# Altium schematic sheet Schem_Control_2021-08-04.schdoc
size 432 x 271 mm
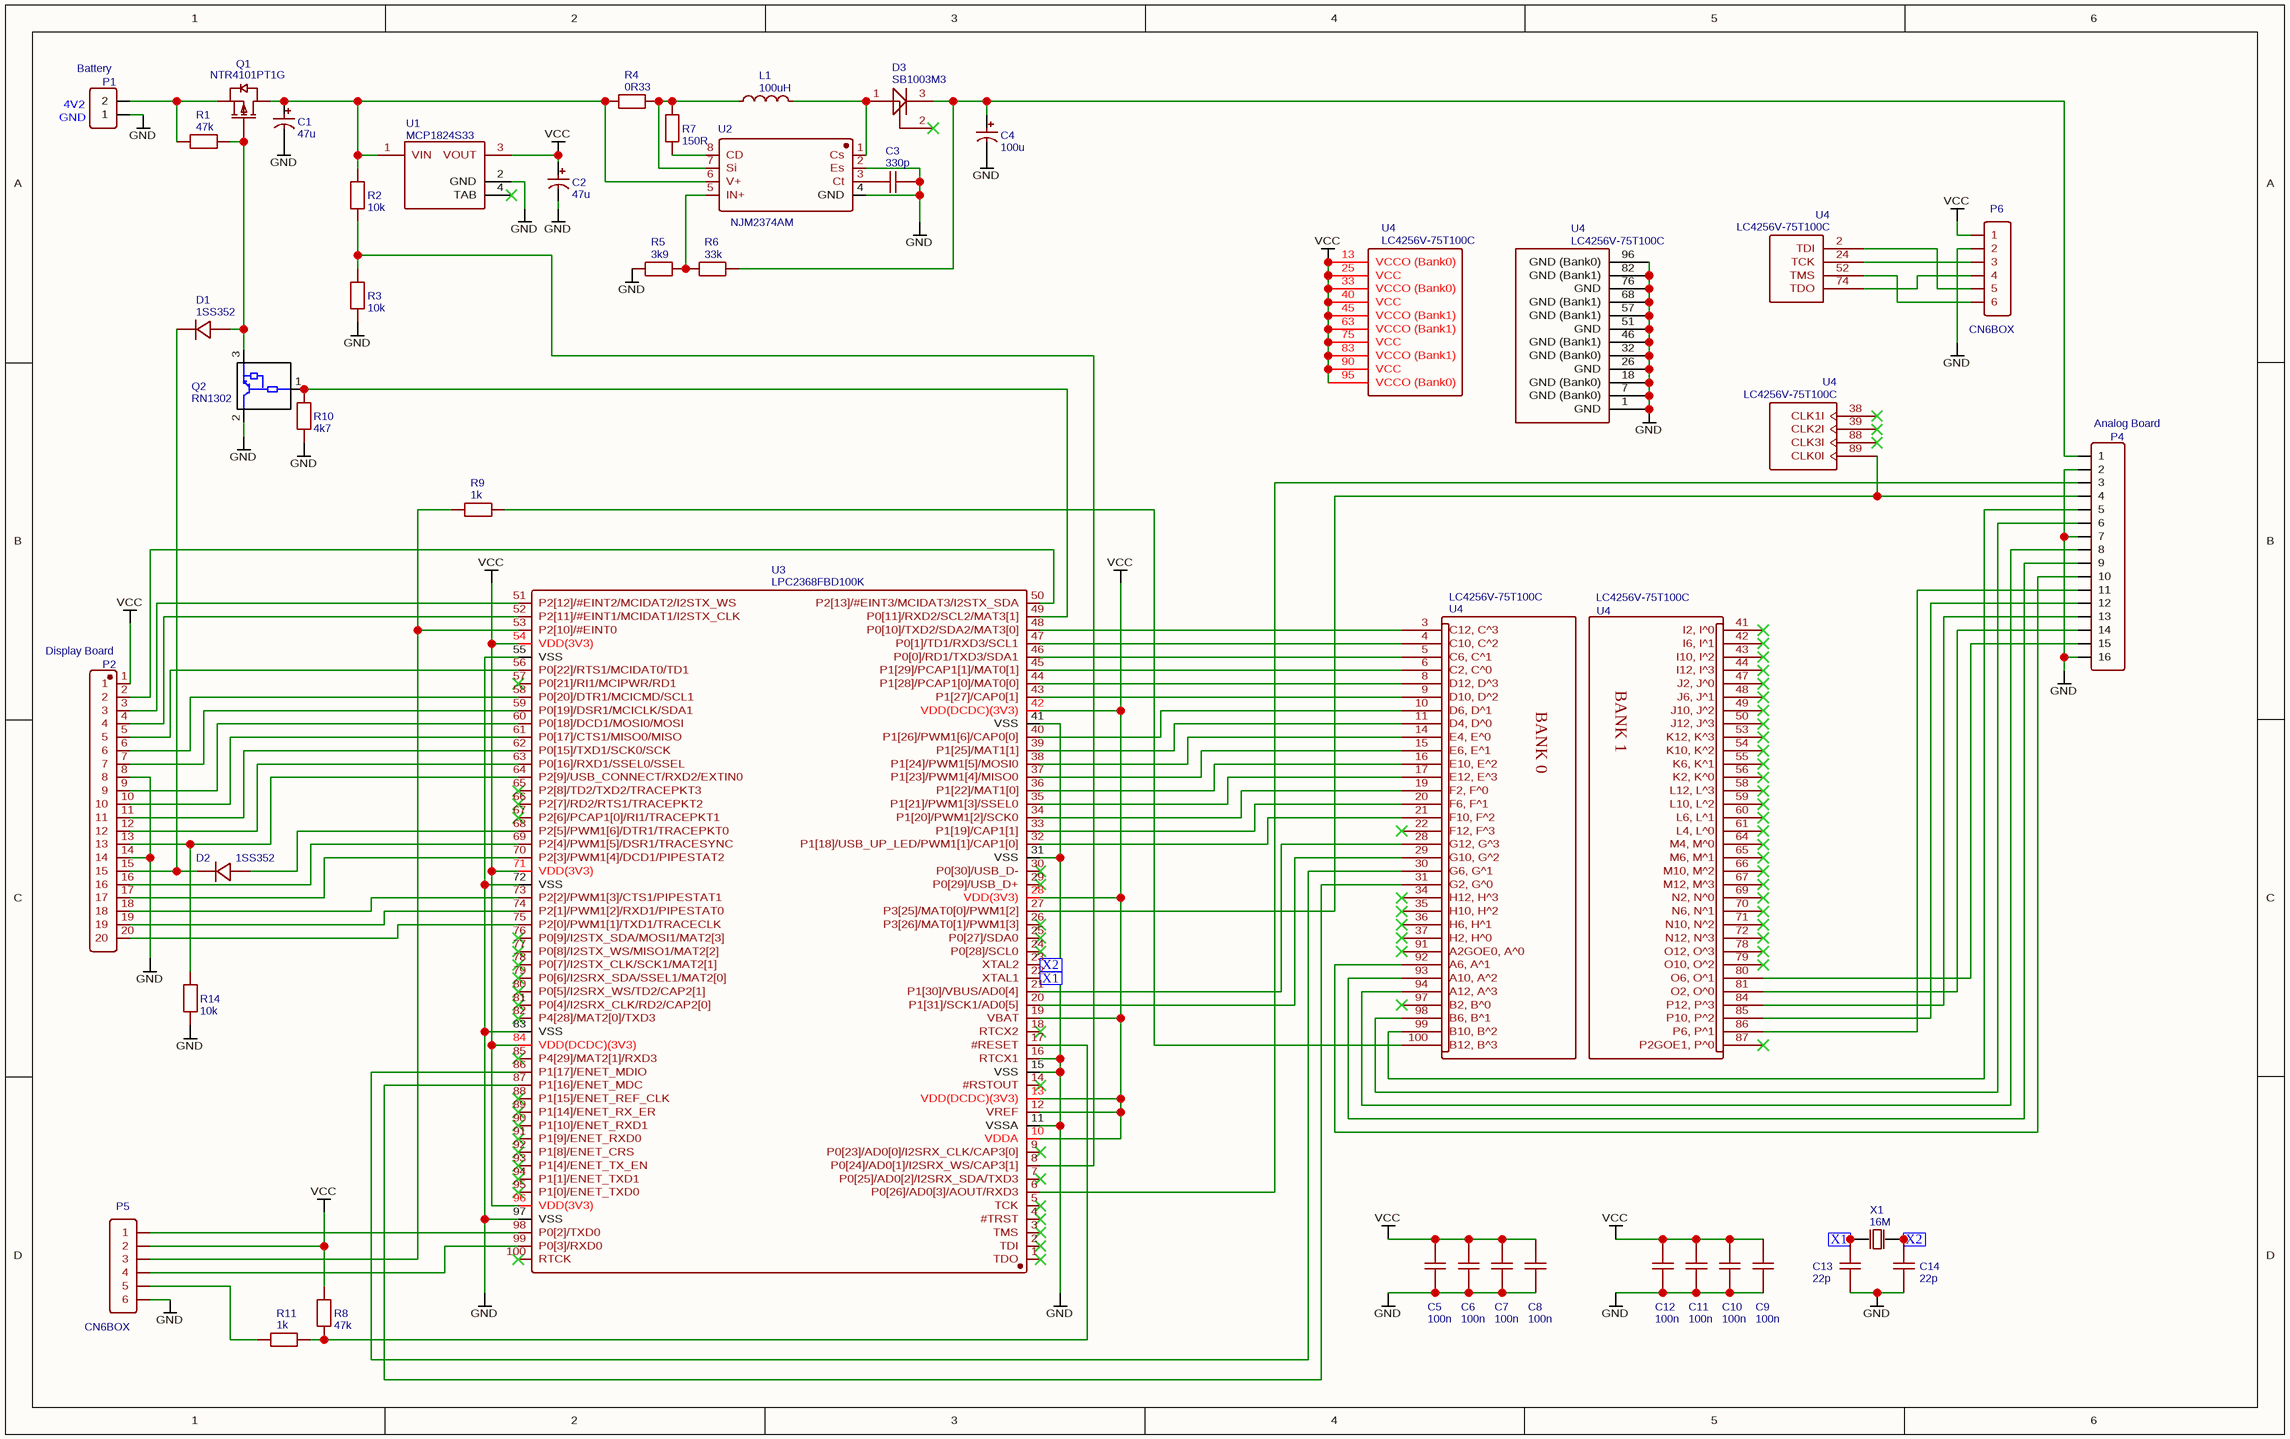
[diagram p0: Schem_Control_2021-08-04.schdoc]

## Parts
(Parts that share a designator on the sheet are numbered #1, #2 ... from top to bottom, then left to right.)
C1  47u  [CAP-TH_BD5.0-P2.00-D0.8-FD]
C2  47u  [CAP-TH_BD5.0-P2.00-D0.8-FD]
C3  330p  [RAD-0.1]
C4  100u  [CAP-TH_BD5.0-P2.00-D0.8-FD]
C5  100n  [RAD-0.1]
C6  100n  [RAD-0.1]
C7  100n  [RAD-0.1]
C8  100n  [RAD-0.1]
C9  100n  [RAD-0.1]
C10  100n  [RAD-0.1]
C11  100n  [RAD-0.1]
C12  100n  [RAD-0.1]
C13  22p  [RAD-0.1]
C14  22p  [RAD-0.1]
D1  1SS352  [SOD-323_L1.8-W1.3-LS2.5-RD]
D2  1SS352  [SOD-323_L1.8-W1.3-LS2.5-RD]
D3  SB1003M3  [-ONSC-MCPH-3_V]
L1  100uH  [IND-TH_BD8.5-P5.00-D0.6]
P1  Battery  [HDR-F-2.54_1X2]
P2  Display Board  [HDR-TH_20P-P2.54-V]
P4  Analog Board  [HDR-TH_16P-P2.54-V]
P5  CN6BOX  [HDR-TH_6P-P2.54-V]
P6  CN6BOX  [HDR-TH_6P-P2.54-V]
Q1  NTR4101PT1G  [SOT-23-3_L2.9-W1.6-P1.90-LS2.8-BR]
Q2  RN1302  [SOT-323-3_L2.0-W1.3-P1.30-LS2.1-BR]
R1  47k  [R_AXIAL-0.3]
R2  10k  [R_AXIAL-0.3]
R3  10k  [R_AXIAL-0.3]
R4  0R33  [R_AXIAL-0.3]
R5  3k9  [R_AXIAL-0.3]
R6  33k  [R_AXIAL-0.3]
R7  150R  [R_AXIAL-0.3]
R8  47k  [R_AXIAL-0.3]
R9  1k  [R_AXIAL-0.3]
R10  4k7  [R_AXIAL-0.3]
R11  1k  [R_AXIAL-0.3]
R14  10k  [R_AXIAL-0.3]
U1  MCP1824S33  [SOT-223_L6.5-W3.5-P2.30-LS7.0-BR]
U2  NJM2374AM  [SOIC-8_L5.3-W5.3-P1.27-LS8.0-BL]
U3  LPC2368FBD100K  [LQFP-100_L14.0-W14.0-P0.50-LS16.0-BL]
U4#1  LC4256V-75T100C  [TQFP100]
U4#2  LC4256V-75T100C  [TQFP100]
U4#3  LC4256V-75T100C  [TQFP100]
U4#4  LC4256V-75T100C  [TQFP100]
U4#5  LC4256V-75T100C  [TQFP100]
U4#6  LC4256V-75T100C  [TQFP100]
X1  16M  [HC-49S_L11.0-W4.4-P4.88]

## Ports
X1 (in), X2 (in)

## Nets
GND: C1.2 C2.2 C3.2 C4.2 C5.1 C6.1 C7.1 C8.1 C9.1 C10.1 C11.1 C12.1 C13.1 C14.1 P1.1 P2.8 P2.14 P4.2 P4.7 P4.16 P5.6 P6.2 Q2.2 R3.1 R5.2 R10.1 R14.1 U1.2(GND) U2.2(Es) U2.4(GND) U3.11(VSSA) U3.15(VSS) U3.16(RTCX1) U3.31(VSS) U3.41(VSS) U3.55(VSS) U3.72(VSS) U3.83(VSS) U3.97(VSS) U4#3.1(GND) U4#3.7(GND_(Bank0)) U4#3.18(GND_(Bank0)) U4#3.26(GND) U4#3.32(GND_(Bank0)) U4#3.46(GND_(Bank1)) U4#3.51(GND) U4#3.57(GND_(Bank1)) U4#3.68(GND_(Bank1)) U4#3.76(GND) U4#3.82(GND_(Bank1)) U4#3.96(GND_(Bank0))
VCC: C2.1 C5.2 C6.2 C7.2 C8.2 C9.2 C10.2 C11.2 C12.2 P2.1 P5.2 P6.1 R8.1 U1.3(VOUT) U3.10(VDDA) U3.12(VREF) U3.13(VDD(DCDC)(3V3)) U3.19(VBAT) U3.28(VDD(3V3)) U3.42(VDD(DCDC)(3V3)) U3.54(VDD(3V3)) U3.71(VDD(3V3)) U3.84(VDD(DCDC)(3V3)) U3.96(VDD(3V3)) U4#2.13(VCCO_(Bank0)) U4#2.25(VCC) U4#2.33(VCCO_(Bank0)) U4#2.40(VCC) U4#2.45(VCCO_(Bank1)) U4#2.63(VCCO_(Bank1)) U4#2.75(VCC) U4#2.83(VCCO_(Bank1)) U4#2.90(VCC) U4#2.95(VCCO_(Bank0))
X1: C13.2 U3.22(XTAL1) X1.1(OSC1) ; port X1
X2: C14.2 U3.23(XTAL2) X1.2(OSC2) ; port X2
NetC1_1: C1.1 Q1.3(D) R2.2 R4.2 U1.1(VIN) U2.6(V+)
NetC3_1: C3.1 U2.3(Ct)
NetC4_1: C4.1 D3.3(K) P4.1 R6.1
NetD1_1: D1.1(K) D2.1(K) P2.15
NetD1_2: D1.2(A) Q1.1(G) Q2.3 R1.2
NetD2_2: D2.2(A) U3.68(P2[5]/PWM1[6]/DTR1/TRACEPKT0)
NetD3_1: D3.1(A) L1.2 U2.1(Cs)
NetL1_1: L1.1 R4.1 R7.1 U2.7(Si)
NetP1_2: P1.2 Q1.2(S) R1.1
NetP2_2: P2.2 U3.50(P2[13]/#EINT3/MCIDAT3/I2STX_SDA)
NetP2_3: P2.3 U3.51(P2[12]/#EINT2/MCIDAT2/I2STX_WS)
NetP2_4: P2.4 U3.52(P2[11]/#EINT1/MCIDAT1/I2STX_CLK)
NetP2_5: P2.5 U3.56(P0[22]/RTS1/MCIDAT0/TD1)
NetP2_6: P2.6 U3.58(P0[20]/DTR1/MCICMD/SCL1)
NetP2_7: P2.7 U3.59(P0[19]/DSR1/MCICLK/SDA1)
NetP2_9: P2.9 U3.60(P0[18]/DCD1/MOSI0/MOSI)
NetP2_10: P2.10 U3.61(P0[17]/CTS1/MISO0/MISO)
NetP2_11: P2.11 U3.62(P0[15]/TXD1/SCK0/SCK)
NetP2_12: P2.12 U3.63(P0[16]/RXD1/SSEL0/SSEL)
NetP2_13: P2.13 R14.2 U3.64(P2[9]/USB_CONNECT/RXD2/EXTIN0)
NetP2_16: P2.16 U3.69(P2[4]/PWM1[5]/DSR1/TRACESYNC)
NetP2_17: P2.17 U3.70(P2[3]/PWM1[4]/DCD1/PIPESTAT2)
NetP2_18: P2.18 U3.73(P2[2]/PWM1[3]/CTS1/PIPESTAT1)
NetP2_19: P2.19 U3.74(P2[1]/PWM1[2]/RXD1/PIPESTAT0)
NetP2_20: P2.20 U3.75(P2[0]/PWM1[1]/TXD1/TRACECLK)
NetP4_3: P4.3 U3.6(P0[26]/AD0[3]/AOUT/RXD3)
NetP4_4: P4.4 U3.27(P3[25]/MAT0[0]/PWM1[2]) U4#4.89(CLK0I)
NetP4_5: P4.5 U4#5.99(B10,_B^2)
NetP4_6: P4.6 U4#5.98(B6,_B^1)
NetP4_8: P4.8 U4#5.94(A12,_A^3)
NetP4_9: P4.9 U4#5.93(A10,_A^2)
NetP4_10: P4.10 U4#5.92(A6,_A^1)
NetP4_11: P4.11 U4#6.86(P6,_P^1)
NetP4_12: P4.12 U4#6.85(P10,_P^2)
NetP4_13: P4.13 U4#6.84(P12,_P^3)
NetP4_14: P4.14 U4#6.81(O2,_O^0)
NetP4_15: P4.15 U4#6.80(O6,_O^1)
NetP5_1: P5.1 U3.98(P0[2]/TXD0)
NetP5_3: P5.3 R9.2 U3.53(P2[10]/#EINT0)
NetP5_4: P5.4 U3.99(P0[3]/RXD0)
NetP5_5: P5.5 R11.2
NetP6_3: P6.3 U4#1.24(TCK)
NetP6_4: P6.4 U4#1.74(TDO)
NetP6_5: P6.5 U4#1.2(TDI)
NetP6_6: P6.6 U4#1.52(TMS)
NetQ2_1: Q2.1 R10.2 U3.49(P0[11]/RXD2/SCL2/MAT3[1])
NetR2_1: R2.1 R3.2 U3.8(P0[24]/AD0[1]/I2SRX_WS/CAP3[1])
NetR5_1: R5.1 R6.2 U2.5(IN+)
NetR7_2: R7.2 U2.8(CD)
NetR8_2: R8.2 R11.1 U3.17(#RESET)
NetR9_1: R9.1 U4#5.100(B12,_B^3)
NetU3_20: U3.20(P1[31]/SCK1/AD0[5]) U4#5.29(G10,_G^2)
NetU3_21: U3.21(P1[30]/VBUS/AD0[4]) U4#5.28(G12,_G^3)
NetU3_32: U3.32(P1[18]/USB_UP_LED/PWM1[1]/CAP1[0]) U4#5.21(F10,_F^2)
NetU3_33: U3.33(P1[19]/CAP1[1]) U4#5.20(F6,_F^1)
NetU3_34: U3.34(P1[20]/PWM1[2]/SCK0) U4#5.19(F2,_F^0)
NetU3_35: U3.35(P1[21]/PWM1[3]/SSEL0) U4#5.17(E12,_E^3)
NetU3_36: U3.36(P1[22]/MAT1[0]) U4#5.16(E10,_E^2)
NetU3_37: U3.37(P1[23]/PWM1[4]/MISO0) U4#5.15(E6,_E^1)
NetU3_38: U3.38(P1[24]/PWM1[5]/MOSI0) U4#5.14(E4,_E^0)
NetU3_39: U3.39(P1[25]/MAT1[1]) U4#5.11(D4,_D^0)
NetU3_40: U3.40(P1[26]/PWM1[6]/CAP0[0]) U4#5.10(D6,_D^1)
NetU3_43: U3.43(P1[27]/CAP0[1]) U4#5.9(D10,_D^2)
NetU3_44: U3.44(P1[28]/PCAP1[0]/MAT0[0]) U4#5.8(D12,_D^3)
NetU3_45: U3.45(P1[29]/PCAP1[1]/MAT0[1]) U4#5.6(C2,_C^0)
NetU3_46: U3.46(P0[0]/RD1/TXD3/SDA1) U4#5.5(C6,_C^1)
NetU3_47: U3.47(P0[1]/TD1/RXD3/SCL1) U4#5.4(C10,_C^2)
NetU3_48: U3.48(P0[10]/TXD2/SDA2/MAT3[0]) U4#5.3(C12,_C^3)
NetU3_86: U3.86(P1[17]/ENET_MDIO) U4#5.30(G6,_G^1)
NetU3_87: U3.87(P1[16]/ENET_MDC) U4#5.31(G2,_G^0)

Not connected (* = marked no-connect by the designer): D3 2(NC)*; U1 4(TAB)*; U3 1(TDO)* 2(TDI)* 3(TMS)* 4(#TRST)* 5(TCK)* 7(P0[25]/AD0[2]/I2SRX_SDA/TXD3)* 9(P0[23]/AD0[0]/I2SRX_CLK/CAP3[0])* 14(#RSTOUT)* 18(RTCX2)* 24(P0[28]/SCL0)* 25(P0[27]/SDA0)* 26(P3[26]/MAT0[1]/PWM1[3])* 29(P0[29]/USB_D+)* 30(P0[30]/USB_D-)* 57(P0[21]/RI1/MCIPWR/RD1)* 65(P2[8]/TD2/TXD2/TRACEPKT3)* 66(P2[7]/RD2/RTS1/TRACEPKT2)* 67(P2[6]/PCAP1[0]/RI1/TRACEPKT1)* 76(P0[9]/I2STX_SDA/MOSI1/MAT2[3])* 77(P0[8]/I2STX_WS/MISO1/MAT2[2])* 78(P0[7]/I2STX_CLK/SCK1/MAT2[1])* 79(P0[6]/I2SRX_SDA/SSEL1/MAT2[0])* 80(P0[5]/I2SRX_WS/TD2/CAP2[1])* 81(P0[4]/I2SRX_CLK/RD2/CAP2[0])* 82(P4[28]/MAT2[0]/TXD3)* 85(P4[29]/MAT2[1]/RXD3)* 88(P1[15]/ENET_REF_CLK)* 89(P1[14]/ENET_RX_ER)* 90(P1[10]/ENET_RXD1)* 91(P1[9]/ENET_RXD0)* 92(P1[8]/ENET_CRS)* 93(P1[4]/ENET_TX_EN)* 94(P1[1]/ENET_TXD1)* 95(P1[0]/ENET_TXD0)* 100(RTCK)*; U4#4 38(CLK1I)* 39(CLK2I)* 88(CLK3I)*; U4#5 22(F12,_F^3)* 34(H12,_H^3)* 35(H10,_H^2)* 36(H6,_H^1)* 37(H2,_H^0)* 91(A2GOE0,_A^0)* 97(B2,_B^0)*; U4#6 41(I2,_I^0)* 42(I6,_I^1)* 43(I10,_I^2)* 44(I12,_I^3)* 47(J2,_J^0)* 48(J6,_J^1)* 49(J10,_J^2)* 50(J12,_J^3)* 53(K12,_K^3)* 54(K10,_K^2)* 55(K6,_K^1)* 56(K2,_K^0)* 58(L12,_L^3)* 59(L10,_L^2)* 60(L6,_L^1)* 61(L4,_L^0)* 64(M4,_M^0)* 65(M6,_M^1)* 66(M10,_M^2)* 67(M12,_M^3)* 69(N2,_N^0)* 70(N6,_N^1)* 71(N10,_N^2)* 72(N12,_N^3)* 78(O12,_O^3)* 79(O10,_O^2)* 87(P2GOE1,_P^0)*

## Notes on the sheet
- (near P1) GND
- (near P1) 4V2
- (in symbol LC4256V-75T100C) BANK 1; BANK 0

## Library data of the parts
C1 C2 = 47u: BOM_Manufacturer: ValuePro; BOM_Manufacturer Part: 47uF 25V 5*11; nameAlias: Capacitance; BOM_Supplier: LCSC; BOM_Supplier Part: C43350; BOM_JLCPCB Part Class: Extended Part; spicePre: C; spiceSymbolName: 47uF 25V 5*11
C3 = 330p: nameAlias: Value(F); Contributor: LCEDA_Lib; spicePre: C; spiceSymbolName: C_RAD-0.1_US
C4 = 100u: BOM_Manufacturer: ValuePro; BOM_Manufacturer Part: 47uF 25V 5*11; nameAlias: Capacitance; BOM_Supplier: LCSC; BOM_Supplier Part: C43350; BOM_JLCPCB Part Class: Extended Part; spicePre: C; spiceSymbolName: 47uF 25V 5*11
C5-C12 = 100n: nameAlias: Value(F); Contributor: LCEDA_Lib; spicePre: C; spiceSymbolName: C_RAD-0.1_US
C13 C14 = 22p: nameAlias: Value(F); Contributor: LCEDA_Lib; spicePre: C; spiceSymbolName: C_RAD-0.1_US
D1 D2 = 1SS352: BOM_Manufacturer: Shikues; Contributor: LCSC; BOM_Supplier: LCSC; BOM_Supplier Part: C475449; BOM_Manufacturer Part: 1SS352; BOM_JLCPCB Part Class: Extended Part; spicePre: D; spiceSymbolName: 1SS352
D3 = SB1003M3: description: Schottky Barrier Diode, 30 V, 1 A, Low IR, Single, 3-Pin MCPH, Pb-Free, Tape and Reel; spicePre: D; spiceSymbolName: SB1003M3-TL-E
L1 = 100uH: BOM_Manufacturer: TE Connectivity; BOM_Manufacturer Part: 5-1624055-5; nameAlias: Inductance; Contributor: LCSC; BOM_Supplier: LCSC; BOM_Supplier Part: C306213; BOM_JLCPCB Part Class: Extended Part; spicePre: L; spiceSymbolName: 5-1624055-5
P1 = Battery: Contributor: LCEDA_Lib; BOM_Supplier Part: C49661; BOM_Supplier: LCSC; spicePre: H; spiceSymbolName: HDR-F-2.54_1x2
P2 = Display Board: BOM_Manufacturer: BOOMELE; BOM_Manufacturer Part: 2.54mm 1*20PHeader; BOM_Supplier: LCSC; BOM_Supplier Part: C50981; BOM_JLCPCB Part Class: Extended Part; spicePre: J; spiceSymbolName: Header-Male-2.54_1x20
P4 = Analog Board: BOM_Manufacturer: BOOMELE; BOM_Manufacturer Part: Female header1*16P pitch 2.54mm; BOM_Supplier: LCSC; BOM_Supplier Part: C66987; BOM_JLCPCB Part Class: Extended Part; spicePre: P; spiceSymbolName: Header-Female-2.54_1x16
P5 P6 = CN6BOX: BOM_Manufacturer: BOOMELE; BOM_Manufacturer Part: Header-Male-2.54_1x6; BOM_Supplier: LCSC; BOM_Supplier Part: C37208; BOM_JLCPCB Part Class: Extended Part; spicePre: H; spiceSymbolName: Header-Male-2.54_1x6
Q1 = NTR4101PT1G: BOM_Manufacturer: ON; BOM_Supplier: LCSC; BOM_Manufacturer Part: NTR4101PT1G; BOM_Supplier Part: C35920; BOM_JLCPCB Part Class: Extended Part; spicePre: Q; spiceSymbolName: NTR4101PT1G
Q2 = RN1302: Manufacturer: Toshiba; subpart_no: 1; ATLStockNo2: 2130.01; ATLStockNo1: 2130.0137; Order# 2: BCR135S; Contributor: ljj0407; BOM_Manufacturer Part: RN1302; BOM_Manufacturer: TOSHIBA; spicePre: Q; spiceSymbolName: RN1302
R1 R8 = 47k: nameAlias: Value(Ω); Contributor: LCEDA_Lib; spicePre: R; spiceSymbolName: R_AXIAL-0.3_EU
R2 R3 R14 = 10k: nameAlias: Value(Ω); Contributor: LCEDA_Lib; spicePre: R; spiceSymbolName: R_AXIAL-0.3_EU
R4 = 0R33: nameAlias: Value(Ω); Contributor: LCEDA_Lib; spicePre: R; spiceSymbolName: R_AXIAL-0.3_EU
R5 = 3k9: nameAlias: Value(Ω); Contributor: LCEDA_Lib; spicePre: R; spiceSymbolName: R_AXIAL-0.3_EU
R6 = 33k: nameAlias: Value(Ω); Contributor: LCEDA_Lib; spicePre: R; spiceSymbolName: R_AXIAL-0.3_EU
R7 = 150R: nameAlias: Value(Ω); Contributor: LCEDA_Lib; spicePre: R; spiceSymbolName: R_AXIAL-0.3_EU
R9 R11 = 1k: nameAlias: Value(Ω); Contributor: LCEDA_Lib; spicePre: R; spiceSymbolName: R_AXIAL-0.3_EU
R10 = 4k7: nameAlias: Value(Ω); Contributor: LCEDA_Lib; spicePre: R; spiceSymbolName: R_AXIAL-0.3_EU
U1 = MCP1824S33: BOM_Manufacturer: MICROCHIP; BOM_Manufacturer Part: MCP1824ST-1202E/DB; Contributor: LCSC; BOM_Supplier: LCSC; BOM_Supplier Part: C145627; BOM_JLCPCB Part Class: Extended Part; spicePre: U; spiceSymbolName: MCP1824ST-1202E/DB
U2 = NJM2374AM: BOM_Manufacturer: JRC; BOM_Manufacturer Part: NJM2374AM-TE1-#ZZZB; Contributor: LCSC; BOM_Supplier: LCSC; BOM_Supplier Part: C15889; BOM_JLCPCB Part Class: Extended Part; spicePre: U; spiceSymbolName: NJM2374AM-TE1-#ZZZB
U3 = LPC2368FBD100K: BOM_Manufacturer: NXP Semicon; Contributor: LCSC; BOM_Supplier: LCSC; BOM_Supplier Part: C698184; BOM_Manufacturer Part: LPC2368FBD100K; BOM_JLCPCB Part Class: Extended Part; spicePre: U; spiceSymbolName: LPC2368FBD100K
U4#1-U4#6 = LC4256V-75T100C: subpart_no: 1; description: ispMACH 4256 SuperFAST High Density PLD, 3.3 V, 64 User IOs, 100-Pin TQFP, 7.5 ns, Commercial Grade; spicePre: U; spiceSymbolName: LC4256V-75T100C
X1 = 16M: BOM_Manufacturer: JYJE(晶友嘉); BOM_Manufacturer Part: S1C13560ZWFAC; Contributor: LCSC; BOM_Supplier: LCSC; BOM_Supplier Part: C2149383; BOM_JLCPCB Part Class: Extended Part; spicePre: X; spiceSymbolName: S1C13560ZWFAC